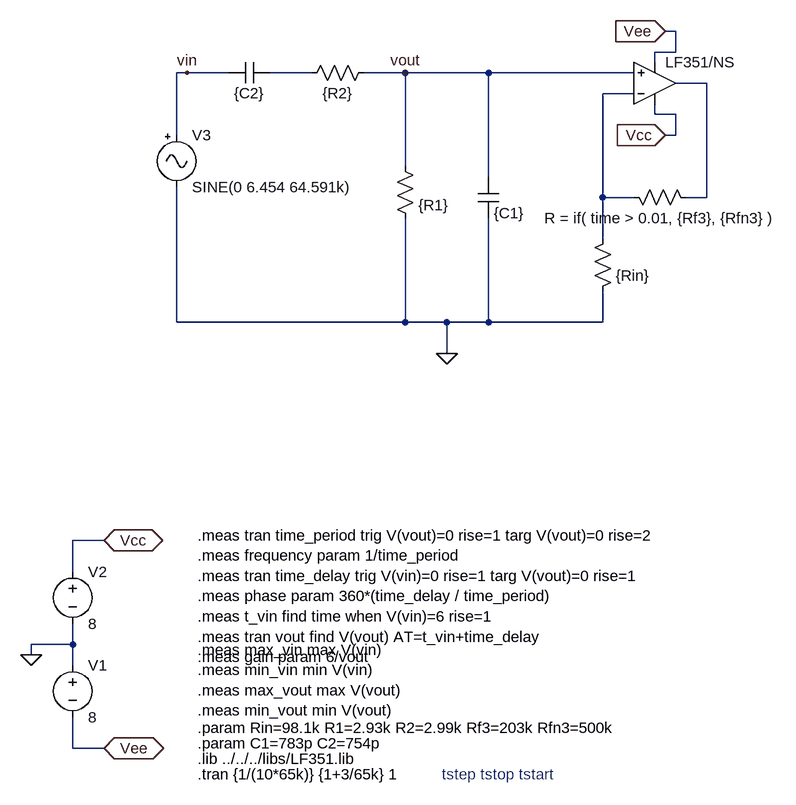
[diagram p0: schematic debugB_practical.asc]
debugB_practical.asc, the LTspice schematic file:
Version 4
SHEET 1 928 1296
WIRE 288 -16 272 -16
WIRE 288 16 288 -16
WIRE 288 16 256 16
WIRE 256 32 256 16
WIRE -464 48 -480 48
WIRE -400 48 -464 48
WIRE -272 48 -336 48
WIRE -128 48 -192 48
WIRE 0 48 -128 48
WIRE 224 48 0 48
WIRE 336 64 288 64
WIRE 224 80 176 80
WIRE 256 112 256 96
WIRE 288 112 256 112
WIRE -480 144 -480 48
WIRE 288 144 288 112
WIRE 288 144 272 144
WIRE -128 192 -128 48
WIRE 0 208 0 48
WIRE 176 240 176 80
WIRE 224 240 176 240
WIRE 336 240 336 64
WIRE 336 240 304 240
WIRE 176 304 176 240
WIRE -480 432 -480 224
WIRE -128 432 -128 272
WIRE -128 432 -480 432
WIRE -64 432 -128 432
WIRE 0 432 0 272
WIRE 0 432 -64 432
WIRE 176 432 176 384
WIRE 176 432 0 432
WIRE -64 480 -64 432
WIRE -592 768 -640 768
WIRE -640 816 -640 768
WIRE -640 928 -640 896
WIRE -640 928 -704 928
WIRE -704 944 -704 928
WIRE -640 960 -640 928
WIRE -640 1088 -640 1040
WIRE -592 1088 -640 1088
FLAG 272 144 Vcc
IOPIN 272 144 In
FLAG 272 -16 Vee
IOPIN 272 -16 In
FLAG -704 944 0
FLAG -592 768 Vcc
IOPIN -592 768 BiDir
FLAG -592 1088 Vee
IOPIN -592 1088 BiDir
FLAG -128 48 vout
FLAG -464 48 vin
FLAG -64 480 0
SYMBOL opamp2 256 128 M180
WINDOW 0 16 32 Invisible 2
SYMATTR InstName U1
SYMATTR Value LF351/NS
SYMBOL res 320 256 M270
WINDOW 0 32 56 Invisible 2
WINDOW 3 0 56 VBottom 2
SYMATTR InstName R1
SYMATTR Value R = if( time > 0.01, {Rf3}, {Rfn3} )
SYMBOL res 160 400 M180
WINDOW 0 36 76 Invisible 2
WINDOW 3 36 40 Left 2
SYMATTR InstName R2
SYMATTR Value {Rin}
SYMBOL res -144 176 R0
WINDOW 0 36 40 Invisible 2
SYMATTR InstName R3
SYMATTR Value {R1}
SYMBOL cap -16 208 R0
WINDOW 0 24 8 Invisible 2
SYMATTR InstName C1
SYMATTR Value {C1}
SYMBOL res -176 32 R90
WINDOW 0 0 56 Invisible 2
WINDOW 3 32 56 VTop 2
SYMATTR InstName R4
SYMATTR Value {R2}
SYMBOL cap -336 32 R90
WINDOW 0 0 32 Invisible 2
WINDOW 3 32 32 VTop 2
SYMATTR InstName C2
SYMATTR Value {C2}
SYMBOL voltage -640 944 R0
SYMATTR InstName V1
SYMATTR Value 8
SYMBOL voltage -640 800 R0
SYMATTR InstName V2
SYMATTR Value 8
SYMBOL Misc/signal -480 128 R0
SYMATTR InstName V3
SYMATTR Value SINE(0 6.454 64.591k)
TEXT -448 1104 Left 2 !.lib ../../../libs/LF351.lib
TEXT -448 1128 Left 2 !.tran {1/(10*65k)} {1+3/65k} 1
TEXT -72 1128 Left 2 ;tstep tstop tstart
TEXT -448 760 Left 2 !.meas tran time_period trig V(vout)=0 rise=1 targ V(vout)=0 rise=2\n.meas frequency param 1/time_period\n.meas tran time_delay trig V(vin)=0 rise=1 targ V(vout)=0 rise=1\n.meas phase param 360*(time_delay / time_period)\n.meas t_vin find time when V(vin)=6 rise=1\n.meas tran vout find V(vout) AT=t_vin+time_delay\n.meas gain param 6/vout
TEXT -448 1056 Left 2 !.param Rin=98.1k R1=2.93k R2=2.99k Rf3=203k Rfn3=500k
TEXT -448 1080 Left 2 !.param C1=783p C2=754p
TEXT -448 936 Left 2 !.meas max_vin max V(vin)\n.meas min_vin min V(vin)\n.meas max_vout max V(vout)\n.meas min_vout min V(vout)

The netlist it stands for:
* debugB_practical.asc
XU1 vout N003 Vcc Vee N002 LF351/NS  ; pins In+ In- V+ V- OUT
R1 N002 N003 R = if( time > 0.01, {Rf3}, {Rfn3} )
R2 0 N003 {Rin}
R3 vout 0 {R1}
C1 vout 0 {C1}
R4 vout N001 {R2}
C2 N001 vin {C2}
V1 0 Vee 8
V2 Vcc 0 8
V3 vin 0 SINE(0 6.454 64.591k)
.lib ../../../libs/LF351.lib
.tran {1/(10*65k)} {1+3/65k} 1
* tstep tstop tstart
.meas tran time_period trig V(vout)=0 rise=1 targ V(vout)=0 rise=2
.meas frequency param 1/time_period
.meas tran time_delay trig V(vin)=0 rise=1 targ V(vout)=0 rise=1
.meas phase param 360*(time_delay / time_period)
.meas t_vin find time when V(vin)=6 rise=1
.meas tran vout find V(vout) AT=t_vin+time_delay
.meas gain param 6/vout
.param Rin=98.1k R1=2.93k R2=2.99k Rf3=203k Rfn3=500k
.param C1=783p C2=754p
.meas max_vin max V(vin)
.meas min_vin min V(vin)
.meas max_vout max V(vout)
.meas min_vout min V(vout)
.backanno
.end